# Altium schematic sheet [03] - 28PINS SHEMATIC.SchDoc (part 1 of 3)
size A1
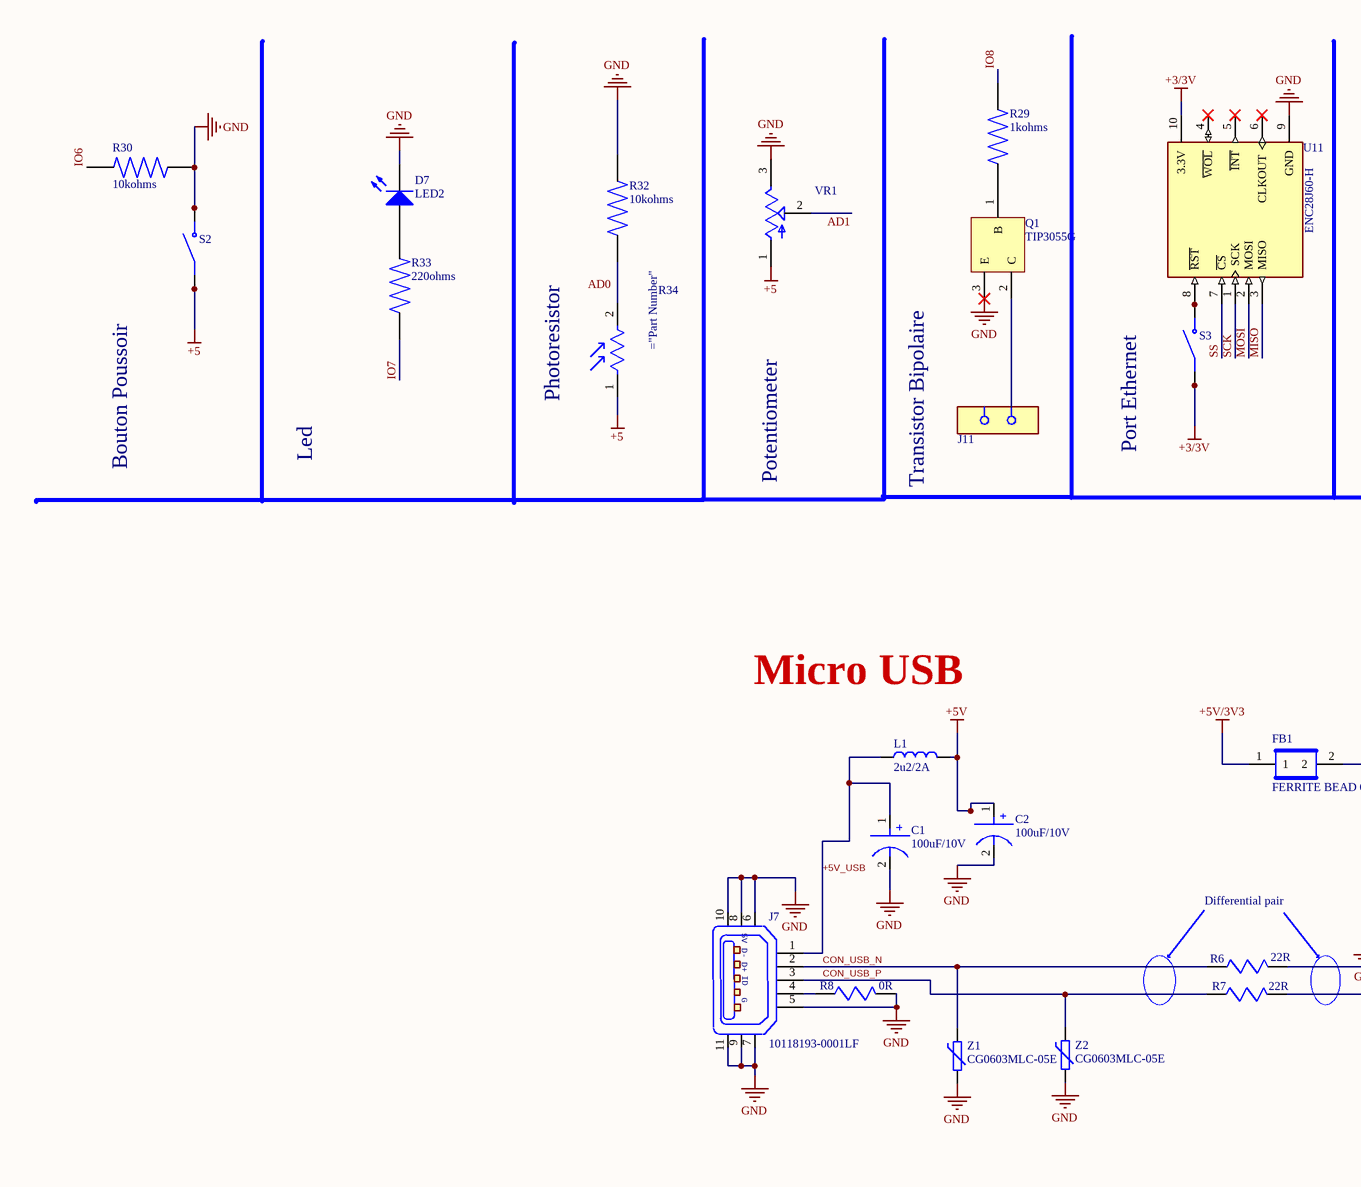
[diagram p0: [03] - 28PINS SHEMATIC.SchDoc, top left]
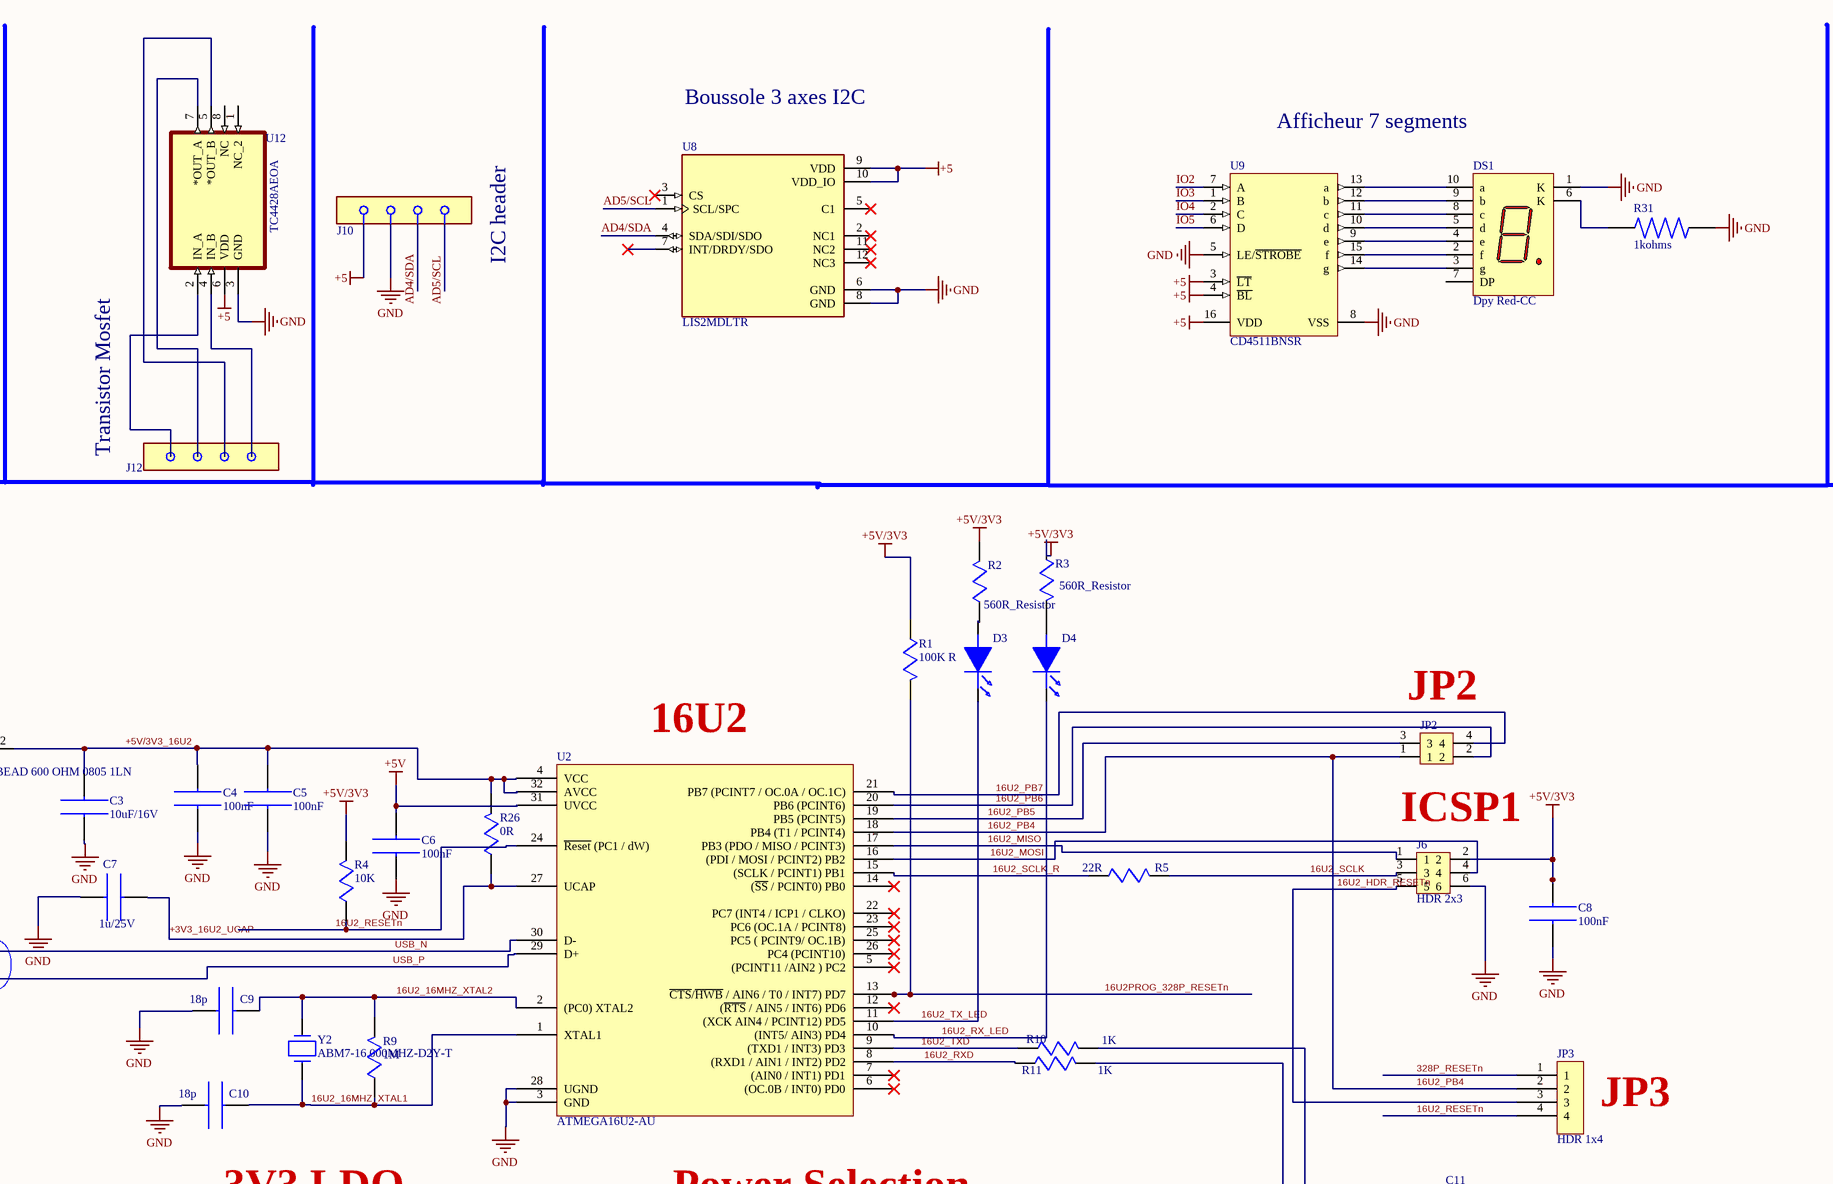
[diagram p1: [03] - 28PINS SHEMATIC.SchDoc, top middle]
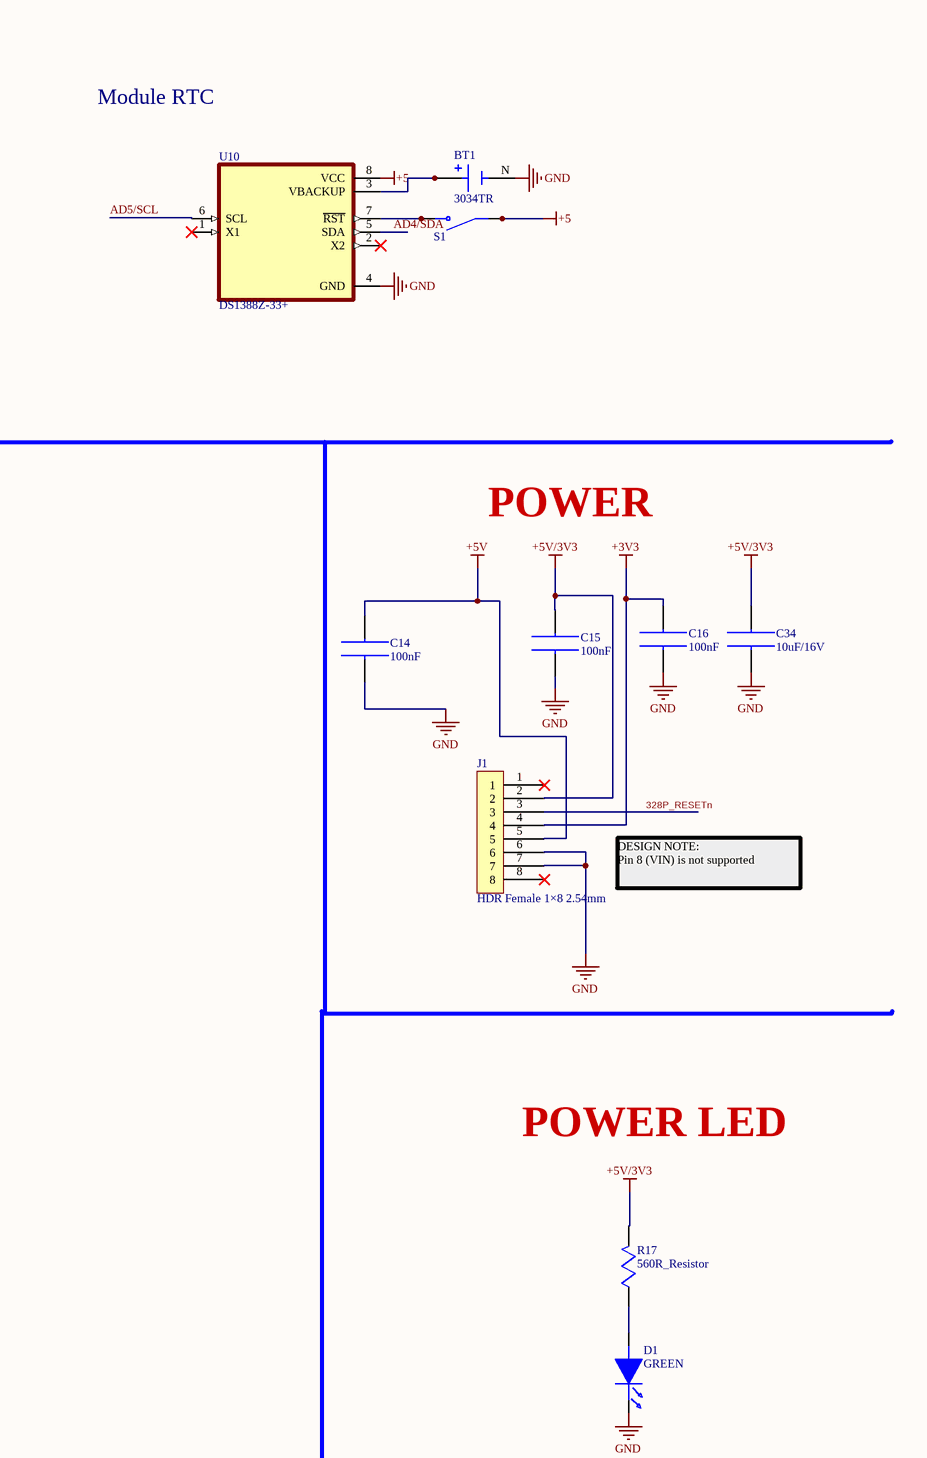
[diagram p2: [03] - 28PINS SHEMATIC.SchDoc, top right]
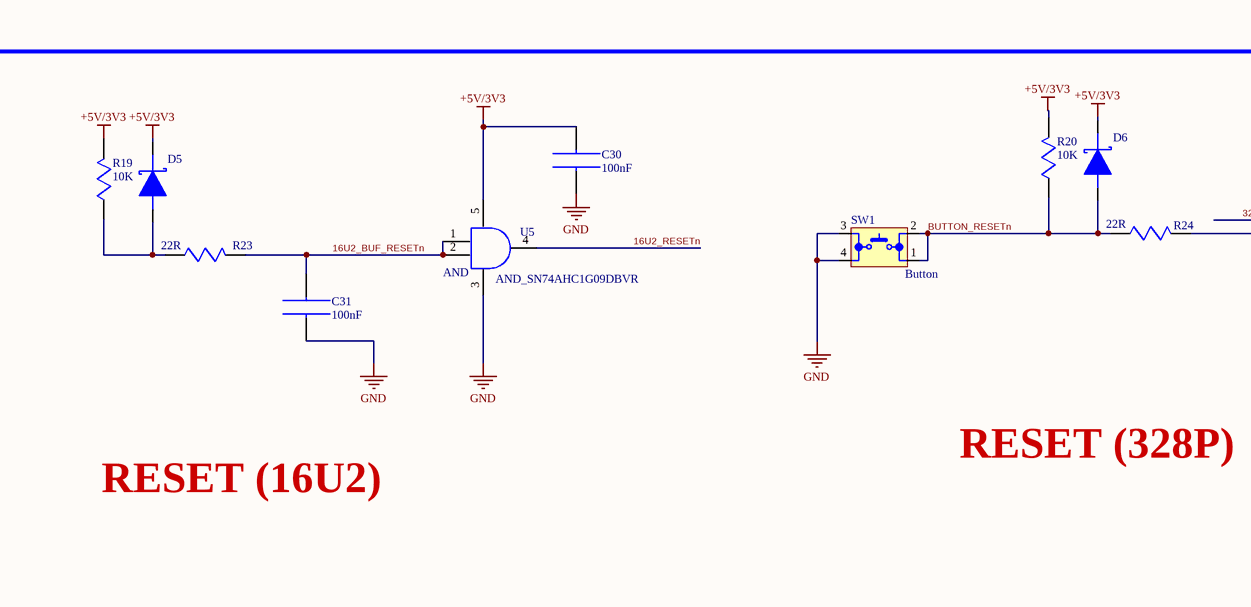
[diagram p3: [03] - 28PINS SHEMATIC.SchDoc, bottom left]
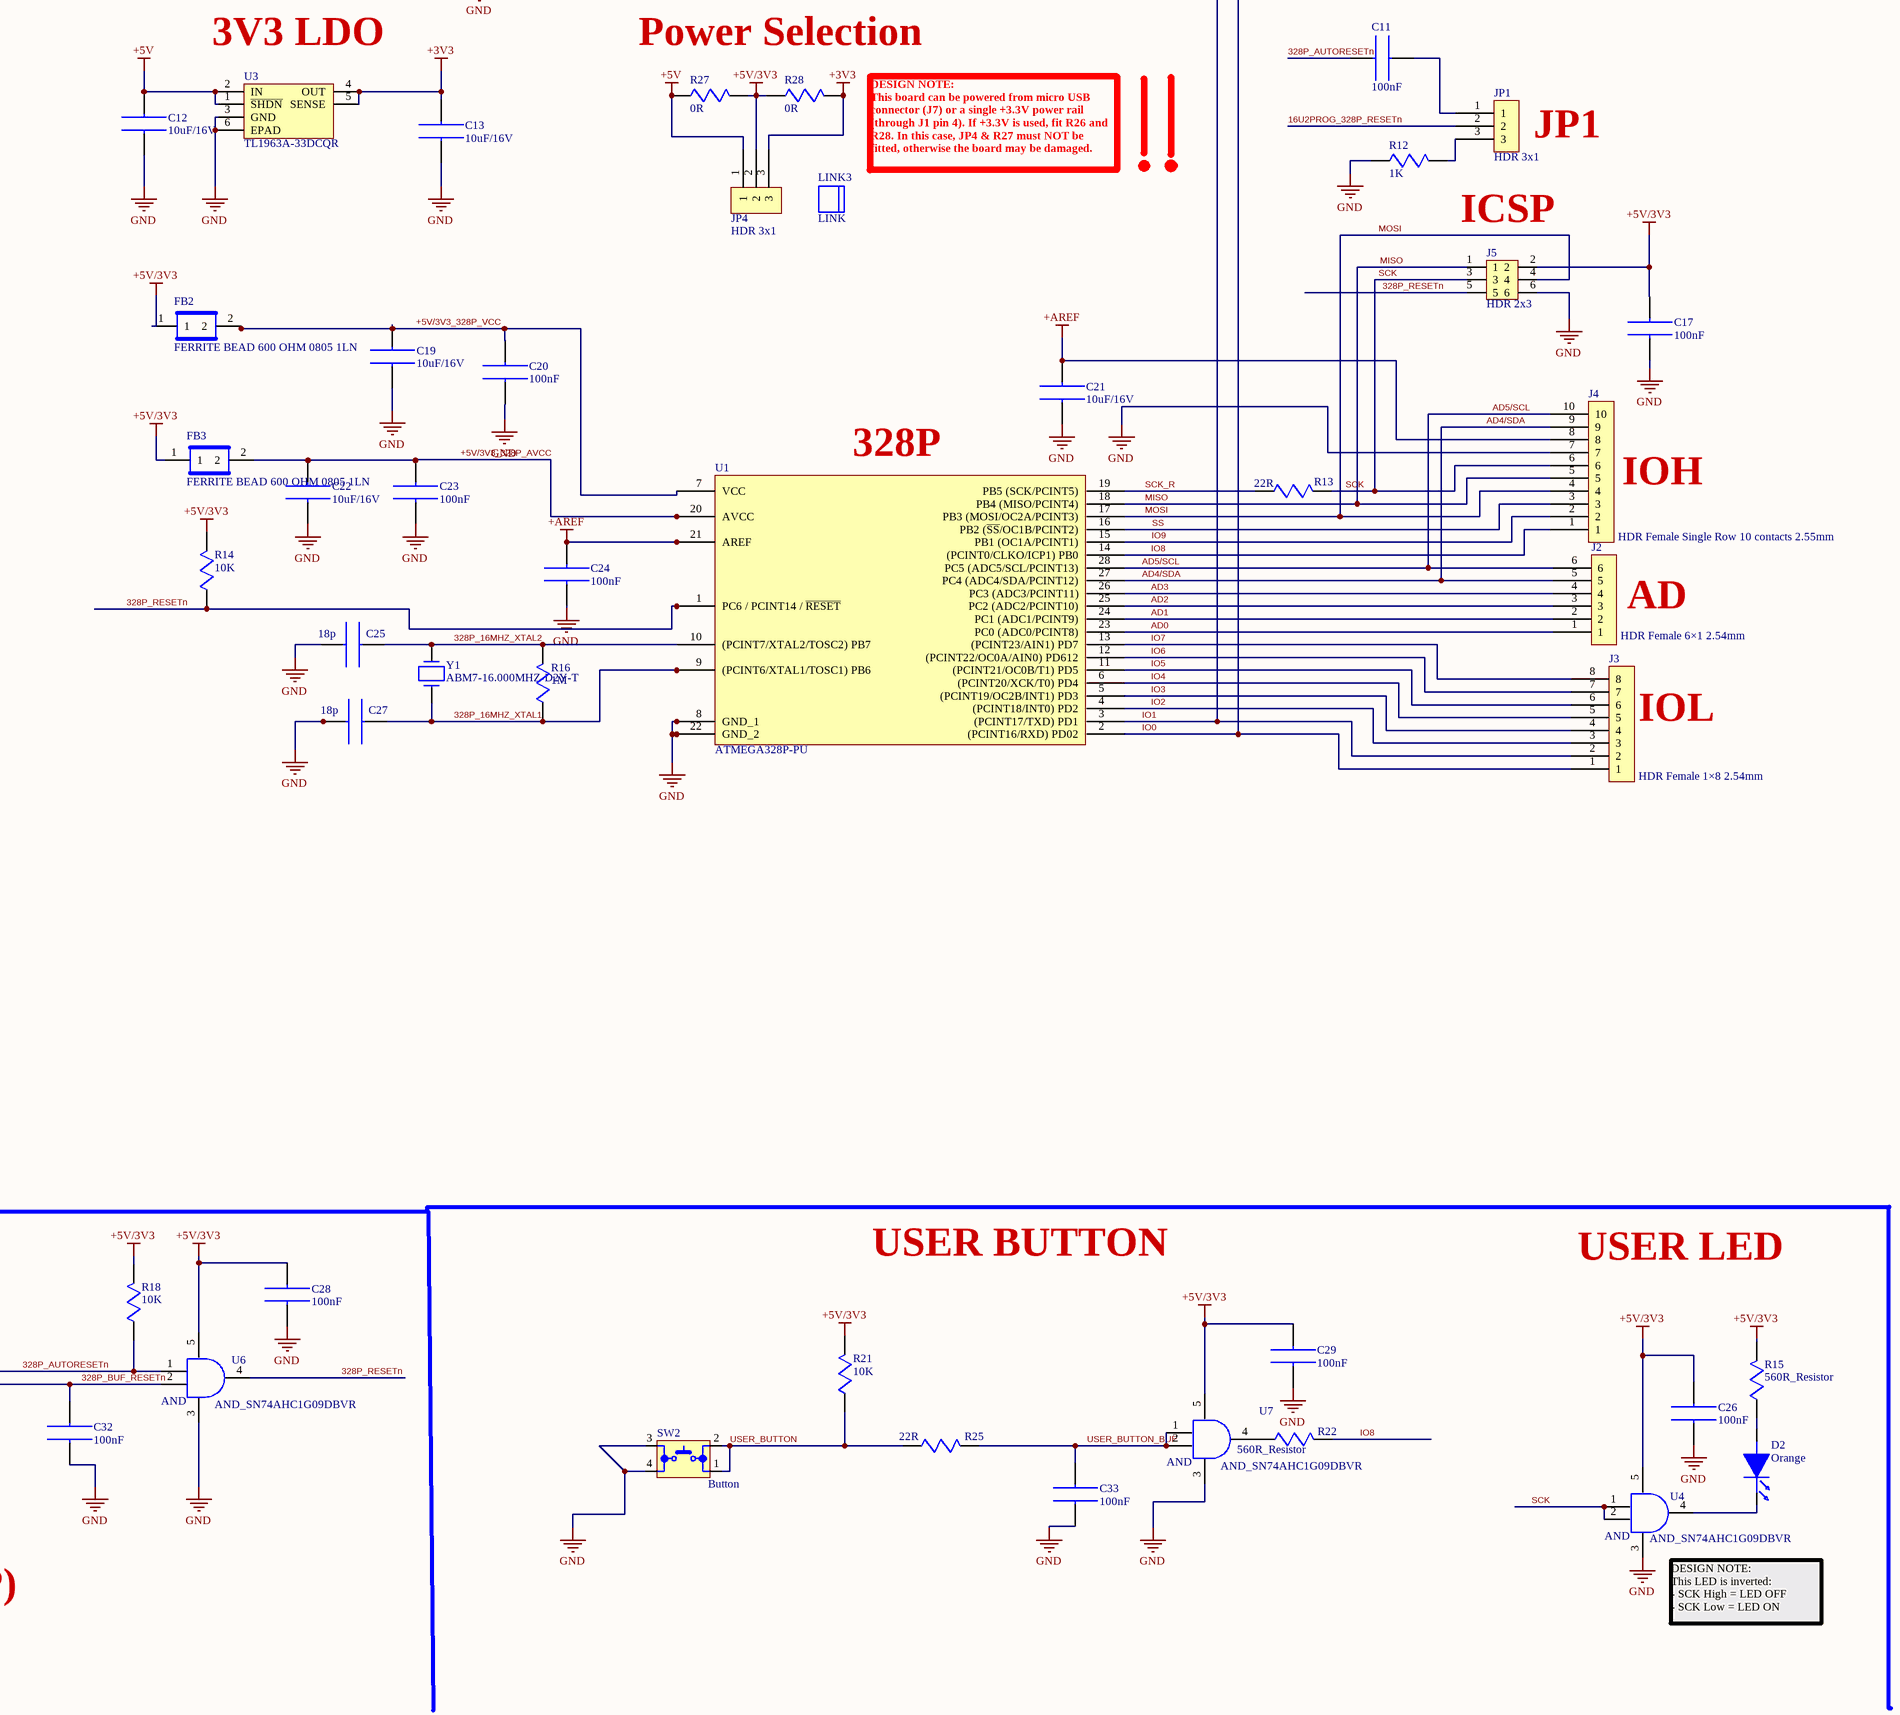
[diagram p4: [03] - 28PINS SHEMATIC.SchDoc, bottom middle]
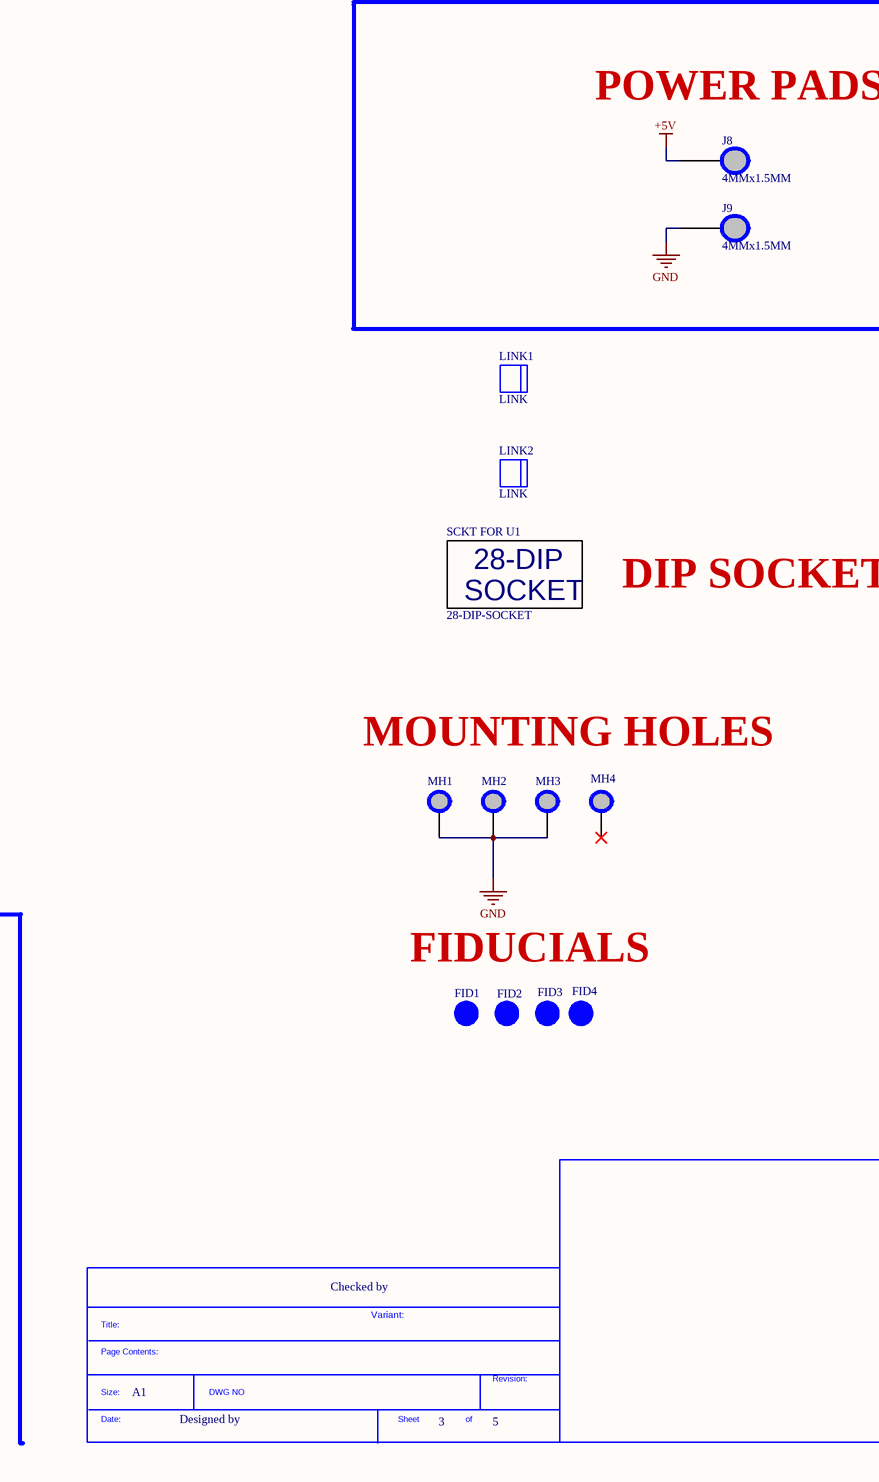
[diagram p5: [03] - 28PINS SHEMATIC.SchDoc, bottom right]

## Parts
*?  SDTitleBlock  (value not drawn)  (graphical)
BT1  3034TR  [BAT_3034TR]
C1  100uF/10V  [C-ALU_C_SIZE]
C2  100uF/10V  [C-ALU_C_SIZE]
C3  10uF/16V  [C0805 10nF 145 hight]
C4  100nF  [C0805]
C5  100nF  [C0805]
C6  100nF  [C0805]
C7  1u/25V  [C0805]
C8  100nF  [C0805]
C9  18p  [C0805]
C10  18p  [C0805]
C11  100nF  [C0805]
C12  10uF/16V  [C0805 10nF 145 hight]
C13  10uF/16V  [C0805 10nF 145 hight]
C14  100nF  [C0805]
C15  100nF  [C0805]
C16  100nF  [C0805]
C17  100nF  [C0805]
C19  10uF/16V  [C0805 10nF 145 hight]
C20  100nF  [C0805]
C21  10uF/16V  [C0805 10nF 145 hight]
C22  10uF/16V  [C0805 10nF 145 hight]
C23  100nF  [C0805]
C24  100nF  [C0805]
C25  18p  [C0805]
C26  100nF  [C0805]
C27  18p  [C0805]
C28  100nF  [C0805]
C29  100nF  [C0805]
C30  100nF  [C0805]
C31  100nF  [C0805]
C32  100nF  [C0805]
C33  100nF  [C0805]
C34  10uF/16V  [C0805 10nF 145 hight]
D1  GREEN  [Orange_LED]
D2  Orange  [Orange_LED]
D3  Orange  [Orange_LED]  (value not drawn)
D4  Orange  [Orange_LED]  (value not drawn)
D5  BAT54HT1G: Schottky Diode  [SOD323]  (value not drawn)
D6  BAT54HT1G: Schottky Diode  [SOD323]  (value not drawn)
D7  LED2  [3.2X1.6X1.1]
DS1  Dpy Red-CC  [A]
FB1  FERRITE BEAD 600 OHM 0805 1LN  [C0805]
FB2  FERRITE BEAD 600 OHM 0805 1LN  [C0805]
FB3  FERRITE BEAD 600 OHM 0805 1LN  [C0805]
FID1  FID_1MMC  [FID_40x120D]  (value not drawn)  (no BOM)
FID2  FID_1MMC  [FID_40x120D]  (value not drawn)  (no BOM)
FID3  FID_1MMC  [FID_40x120D]  (value not drawn)  (no BOM)
FID4  FID_1MMC  [FID_40x120D]  (value not drawn)  (no BOM)
J1  HDR Female 1×8 2.54mm  [HDR Female 1×8 2.54mm]
J2  HDR Female 6×1 2.54mm  [HDR Female 1×6 2.54mm]
J3  HDR Female 1×8 2.54mm  [HDR Female 1×8 2.54mm]
J4  HDR Female Single Row 10 contacts 2.55mm  [Female_Header_10]
J5  HDR 2x3  [HDR_2x3_2.55mm]
J6  HDR 2x3  [HDR_2x3_2.55mm]
J7  10118193-0001LF  [10118193_USB]
J8  4MMx1.5MM  [PAD_WITH_HOLE_4MMx1.5MM]  (no BOM)
J9  4MMx1.5MM  [PAD_WITH_HOLE_4MMx1.5MM]  (no BOM)
J10  50-57-9004  [Molex_0_MFG]  (value not drawn)
J11  15-29-1025  [Molex_0_MFG]  (value not drawn)
J12  50-57-9004  [Molex_0_MFG]  (value not drawn)
JP1  HDR 3x1  [HDR 1×3 2.54mm]
JP2  HDR 2x2  [HDR_2x2_2.54mm]  (value not drawn)
JP3  HDR 1x4  [HDR Female 1×4 2.54mm]
JP4  HDR 3x1  [HDR 1×3 2.54mm]
L1  2u2/2A  [C120_IND]
LINK1  LINK  (mechanical)
LINK2  LINK  (mechanical)
LINK3  LINK  (mechanical)
MH1  MH_7x4MMC_3.2MMD  [MH_7x4MMC_3.2MMD]  (value not drawn)  (no BOM)
MH2  MH_7x4MMC_3.2MMD  [MH_7x4MMC_3.2MMD]  (value not drawn)  (no BOM)
MH3  MH_7x4MMC_3.2MMD  [MH_7x4MMC_3.2MMD]  (value not drawn)  (no BOM)
MH4  MH_7x4MMNC_3.2MMD  [MH 7.4mm Diametre_non_copper_NPTH]  (value not drawn)  (no BOM)
Q1  TIP3055G  [ONSC-TO-247-3-340L-02]
R1  100K R  [R0805]
R2  560R_Resistor  [R0805]
R3  560R_Resistor  [R0805]
R4  10K  [R0805]
R5  22R  [R0805]
R6  22R  [R0805]
R7  22R  [R0805]
R8  0R  [R0805]
R9  1M  [R0805]
R10  1K  [R0805]
R11  1K  [R0805]
R12  1K  [R0805]
R13  22R  [R0805]
R14  10K  [R0805]
R15  560R_Resistor  [R0805]
R16  1M  [R0805]
R17  560R_Resistor  [R0805]
R18  10K  [R0805]
R19  10K  [R0805]
R20  10K  [R0805]
R21  10K  [R0805]
R22  560R_Resistor  [R0805]
R23  22R  [R0805]
R24  22R  [R0805]
R25  22R  [R0805]
R26  0R  [R0805]
R27  0R  [R0805]
R28  0R  [R0805]
R29  1kohms  [RES_ERJU08F16R0V]
R30  10kohms  [RES_ERJU08F16R0V]
R31  1kohms  [RES_ERJU08F16R0V]
R32  10kohms  [RES_ERJU08F16R0V]
R33  220ohms  [RES_ERJU08F16R0V]
R34  PDV-P9002  [Advanced_Photonix_PDV-P9002_0]  (value not drawn)
S1  PTS_647_SM38_SMTR2_LFS  [SW_PTS_647_SM38_SMTR2_LFS]  (value not drawn)
S2  PTS_647_SM38_SMTR2_LFS  [SW_PTS_647_SM38_SMTR2_LFS]  (value not drawn)
S3  PTS_647_SM38_SMTR2_LFS  [SW_PTS_647_SM38_SMTR2_LFS]  (value not drawn)
SCKT_FOR_U1  28-DIP-SOCKET  [28_DIP_7.62mm_SOCKET]
SW1  Button  [1825910-6_BUTTON]
SW2  Button  [1825910-6_BUTTON]
U1  ATMEGA328P-PU  [27_DIP_7.62mm]
U2  ATMEGA16U2-AU  [TQFP32]
U3  TL1963A-33DCQR  [DCQ (REGULATOR-PDSO-G6)]
U4  AND_SN74AHC1G09DBVR  [DBV_SOT_23_5_AND]
U5  AND_SN74AHC1G09DBVR  [DBV_SOT_23_5_AND]
U6  AND_SN74AHC1G09DBVR  [DBV_SOT_23_5_AND]
U7  AND_SN74AHC1G09DBVR  [DBV_SOT_23_5_AND]
U8  LIS2MDLTR  [PQFN50P200X200X70-12N]
U9  CD4511BNSR  [TI-NS16_M]
U10  DS1388Z-33+  [SOIC127P600X175-8N]
U11  ENC28J60-H  [MODULE_ENC28J60-H]
U12  TC4428AEOA  [SOIC127P600X175-8N]
VR1  3362P-1-102LF  [TRIM_3362P-1-102LF]  (value not drawn)
Y1  ABM7-16.000MHZ-D2Y-T  [Crystal_16MHz_footprint]
Y2  ABM7-16.000MHZ-D2Y-T  [Crystal_16MHz_footprint]
Z1  CG0603MLC-05E  [R0603]
Z2  CG0603MLC-05E  [R0603]

## Nets
+3/3V: S3.3(COM) S3.4(COM) U11.10(3.3V)
+3V3: C13.2 C16.2 J1.4 JP4.3 R28.2 U3.4(OUT) U3.5(SENSE)
+5: R34.1 S1.3(COM) S1.4(COM) S2.3(COM) S2.4(COM) U8.9(VDD) U8.10(VDD_IO) U9.3(~{LT}) U9.4(~{BL}) U9.16(VDD) U10.8(VCC) U12.6(VDD) VR1.1(CCW)
+5V: C2.1 C6.2 C12.2 C14.2 J1.5 J8.1 JP4.1 L1.2 R27.1 U2.31(UVCC) U3.1(~{SHDN}) U3.2(IN)
+5V/3V3: C8.2 C15.2 C17.2 C26.2 C28.2 C29.2 C30.2 C34.2 D5.1(Cathode) D6.1(Cathode) FB1.1 FB2.1 FB3.1 J1.2 J5.2 J6.2 JP4.2 R1.1 R2.2 R3.1 R4.2 R14.2 R15.2 R17.2 R18.2 R19.2 R20.2 R21.2 R27.2 R28.1 U4.5 U5.5 U6.5 U7.5
+AREF: C21.2 C24.2 J4.8 U1.21(AREF)
GND: BT1.N(NEG) C1.2 C2.2 C3.1 C4.1 C5.2 C6.1 C7.1 C8.1 C9.1 C10.1 C12.1 C13.1 C14.1 C15.1 C16.1 C17.1 C19.1 C20.1 C21.1 C22.1 C23.1 C24.1 C25.1 C26.1 C27.1 C28.1 C29.1 C30.1 C31.1 C32.1 C33.1 C34.1 D1.1(Cathode) D7.2(K) DS1.1(K) J1.6 J1.7 J4.7 J5.6 J6.6 J7.5 J7.6 J7.7 J7.8 J7.9 J7.10 J7.11 J9.1 MH1.1 MH2.1 MH3.1 Q1.3(E) R8.2 R12.1 R30.1 R31.1 R32.1 S2.1(NO) S2.2(NO) SW1.3 SW1.4 SW2.3 SW2.4 U1.8(GND_1) U1.22(GND_2) U2.3(GND) U2.28(UGND) U3.3(GND) U3.6(EPAD) U4.3 U5.3 U6.3 U7.3 U8.6(GND) U8.8(GND) U9.5(LE/~{STROBE}) U9.8(VSS) U10.4(GND) U11.9(GND) U12.3(GND) VR1.3(CW) Z1.1 Z2.1
16U2_16MHZ_XTAL1: C10.2 R9.1 U2.1(XTAL1) Y2.1
16U2_16MHZ_XTAL2: C9.2 R9.2 U2.2((PC0)_XTAL2) Y2.2
16U2_BUF_RESETn: C31.2 R23.2 U5.1 U5.2
16U2_HDR_RESETn: J6.5 JP3.3
16U2_MISO: J6.1 U2.17(PB3_(PDO_/_MISO_/_PCINT3))
16U2_MOSI: J6.4 U2.16((PDI_/_MOSI_/_PCINT2)_PB2)
16U2_PB4: JP2.1 JP3.2 U2.18(PB4_(T1_/_PCINT4))
16U2_PB5: JP2.3 U2.19(PB5_(PCINT5))
16U2_PB6: JP2.2 U2.20(PB6_(PCINT6))
16U2_PB7: JP2.4 U2.21(PB7_(PCINT7_/_OC.0A_/_OC.1C))
16U2_RESETn: JP3.4 R4.1 U2.24(~{Reset}_(PC1_/_dW)) U5.4
16U2_RX_LED: D4.1(Cathode) U2.10((INT5/_AIN3)_PD4)
16U2_RXD: R11.1 U2.8((RXD1_/_AIN1_/_INT2)_PD2)
16U2_SCLK: J6.3 R5.2
16U2_SCLK_R: R5.1 U2.15((SCLK_/_PCINT1)_PB1)
16U2_TX_LED: D3.1(Cathode) U2.11((XCK_AIN4_/_PCINT12)_PD5)
16U2_TXD: R10.1 U2.9((TXD1_/_INT3)_PD3)
16U2PROG_328P_RESETn: JP1.2 R1.2 U2.13(~{CTS}/~{HWB}_/_AIN6_/_T0_/_INT7)_PD7)
328P_16MHZ_XTAL1: C27.2 R16.1 U1.9((PCINT6/XTAL1/TOSC1)_PB6) Y1.1
328P_16MHZ_XTAL2: C25.2 R16.2 U1.10((PCINT7/XTAL2/TOSC2)_PB7) Y1.2
328P_AUTORESETn: C11.1 R18.1 U6.1
328P_BUF_RESETn: C32.2 R24.2 U6.2
328P_RESETn: J1.3 J5.5 JP3.1 R14.1 U1.1(PC6_/_PCINT14_/_~{RESET}) U6.4
+3V3_16U2_UCAP: C7.2 R26.1 U2.27(UCAP)
+5V/3V3_16U2: C3.2 C4.2 C5.1 FB1.2 R26.2 U2.4(VCC) U2.32(AVCC)
+5V/3V3_328P_AVCC: C22.2 C23.2 FB3.2 U1.20(AVCC)
+5V/3V3_328P_VCC: C19.2 C20.2 FB2.2 U1.7(VCC)
+5V_USB: C1.1 J7.1 L1.1
AD0: J2.1 U1.23(PC0_(ADC0/PCINT8))
AD1: J2.2 U1.24(PC1_(ADC1/PCINT9)) VR1.2(WIPER)
AD2: J2.3 U1.25(PC2_(ADC2/PCINT10))
AD3: J2.4 U1.26(PC3_(ADC3/PCINT11))
AD4/SDA: J2.5 J4.9 U1.27(PC4_(ADC4/SDA/PCINT12)) U8.4(SDA/SDI/SDO) U10.5(SDA)
AD5/SCL: J2.6 J4.10 U1.28(PC5_(ADC5/SCL/PCINT13)) U8.1(SCL/SPC) U10.6(SCL)
BUTTON_RESETn: D6.2(Anode) R20.1 R24.1 SW1.1 SW1.2
CON_USB_N: J7.2 R6.1 Z1.2
CON_USB_P: J7.3 R7.1
IO0: J3.1 R10.2 U1.2((PCINT16/RXD)_PD02)
IO1: J3.2 R11.2 U1.3((PCINT17/TXD)_PD1)
IO2: J3.3 U1.4((PCINT18/INT0)_PD2) U9.7(A)
IO3: J3.4 U1.5((PCINT19/OC2B/INT1)_PD3) U9.1(B)
IO4: J3.5 U1.6((PCINT20/XCK/T0)_PD4) U9.2(C)
IO5: J3.6 U1.11((PCINT21/OC0B/T1)_PD5) U9.6(D)
IO6: J3.7 R30.2 U1.12((PCINT22/OC0A/AIN0)_PD612)
IO7: J3.8 R33.1 U1.13((PCINT23/AIN1)_PD7)
IO8: J4.1 R22.2 R29.1 U1.14((PCINT0/CLKO/ICP1)_PB0)
IO9: J4.2 U1.15(PB1_(OC1A/PCINT1))
MISO: J4.5 J5.1 U1.18(PB4_(MISO/PCINT4)) U11.3(MISO)
MOSI: J4.4 J5.4 U1.17(PB3_(MOSI/OC2A/PCINT3)) U11.2(MOSI)
SCK: J4.6 J5.3 R13.2 U4.1 U4.2 U11.1(SCK)
SCK_R: R13.1 U1.19(PB5_(SCK/PCINT5))
SS: J4.3 U1.16(PB2_(~{SS}/OC1B/PCINT2)) U11.7(~{CS})
USB_N: R6.2 U2.30(D-)
USB_P: R7.2 U2.29(D+)
USER_BUTTON: R21.1 R25.1 SW2.1 SW2.2
USER_BUTTON_BUF: C33.2 R25.2 U7.1 U7.2
NetBT1_P1: BT1.P1(POS) BT1.P2(POS) U10.3(VBACKUP)
NetC11_2: C11.2 JP1.1
NetD1_2: D1.2(Anode) R17.1
NetD2_1: D2.1(Cathode) U4.4
NetD2_2: D2.2(Anode) R15.1
NetD3_2: D3.2(Anode) R2.1
NetD4_2: D4.2(Anode) R3.2
NetD5_2: D5.2(Anode) R19.1 R23.1
NetD7_1: D7.1(A) R33.2
NetDS1_2: DS1.2(f) U9.15(f)
NetDS1_3: DS1.3(g) U9.14(g)
NetDS1_4: DS1.4(e) U9.9(e)
NetDS1_5: DS1.5(d) U9.10(d)
NetDS1_6: DS1.6(K) R31.2
NetDS1_8: DS1.8(c) U9.11(c)
NetDS1_9: DS1.9(b) U9.12(b)
NetDS1_10: DS1.10(a) U9.13(a)
NetJ7_4: J7.4 R8.1
NetJP1_3: JP1.3 R12.2
NetQ1_1: Q1.1(B) R29.2
NetR22_1: R22.1 U7.4
NetR32_2: R32.2 R34.2
NetS1_1: S1.1(NO) S1.2(NO) U10.7(~{RST})
NetS3_1: S3.1(NO) S3.2(NO) U11.8(~{RST})

Not connected (* = marked no-connect by the designer): DS1 7(DP); J1 1* 8*; MH4 1*; Q1 2(C); U2 5((PCINT11_/AIN2_)_PC2)* 6((OC.0B_/_INT0)_PD0)* 7((AIN0_/_INT1)_PD1)* 12((~{RTS}_/_AIN5_/_INT6)_PD6)* 14((~{SS}_/_PCINT0)_PB0)* 22(PC7_(INT4_/_ICP1_/_CLKO))* 23(PC6_(OC.1A_/_PCINT8))* 25(PC5_(_PCINT9/_OC.1B))* 26(PC4_(PCINT10))*; U8 2(NC1)* 3(CS)* 5(C1)* 7(INT/DRDY/SDO)* 11(NC2)* 12(NC3)*; U10 1(X1)* 2(X2)*; U11 4(~{WOL})* 5(~{INT})* 6(CLKOUT)*; U12 1(NC_2) 2(IN_A) 4(IN_B) 5(*OUT_B) 7(*OUT_A) 8(NC); Z2 2

## Notes on the sheet
- Boussole 3 axes I2C
- Afficheur 7 segments
- Module RTC
- I2C header
- Photoresistor
- Bouton Poussoir
- Led
- Port Ethernet
- Transistor Mosfet
- Potentiometer
- Transistor Bipolaire
- POWER
- Micro USB
- (near JP2) JP2
- (near U2) 16U2
- ICSP1
- Differential pair
- DESIGN NOTE:
  Pin 8 (VIN) is not supported
- (near JP3) JP3
- POWER LED
- 3V3 LDO
- Power Selection
- DESIGN NOTE:
  This board can be powered from micro USB
  connector (J7) or a single +3.3V power rail
  (through J1 pin 4). If +3.3V is used, fit R26 and
  R28. In this case, JP4 & R27 must NOT be
  fitted, otherwise the board may be damaged.
- (near JP1) JP1
- ICSP
- (near U1) 328P
- (near J4) IOH
- (near J8) POWER PADS
- (near J2) AD
- (near J3) IOL
- DIP SOCKET
- MOUNTING HOLES
- USER BUTTON
- FIDUCIALS
- USER LED
- Checked by
- RESET (16U2)
- RESET (328P)
- (near U4) DESIGN NOTE:
  This LED is inverted:
  - SCK High = LED OFF
  - SCK Low = LED ON
- Variant:
- A1
- Designed by
- 3
- 5
- Labels drawn without touching a wire or pin: AD0, AD4/SDA, AD5/SCL
- (in symbol 4828-3004-CP) 28-DIP; SOCKET
- (in symbol 10118193-0001LF) 5V; D-; D+; ID; G
- (in symbol SDTitleBlock) Title:; Page Contents:; Revision:; Size:; DWG NO; Date:; Sheet; of